# Altium schematic sheet 01_DC_Power.SchDoc
size A3
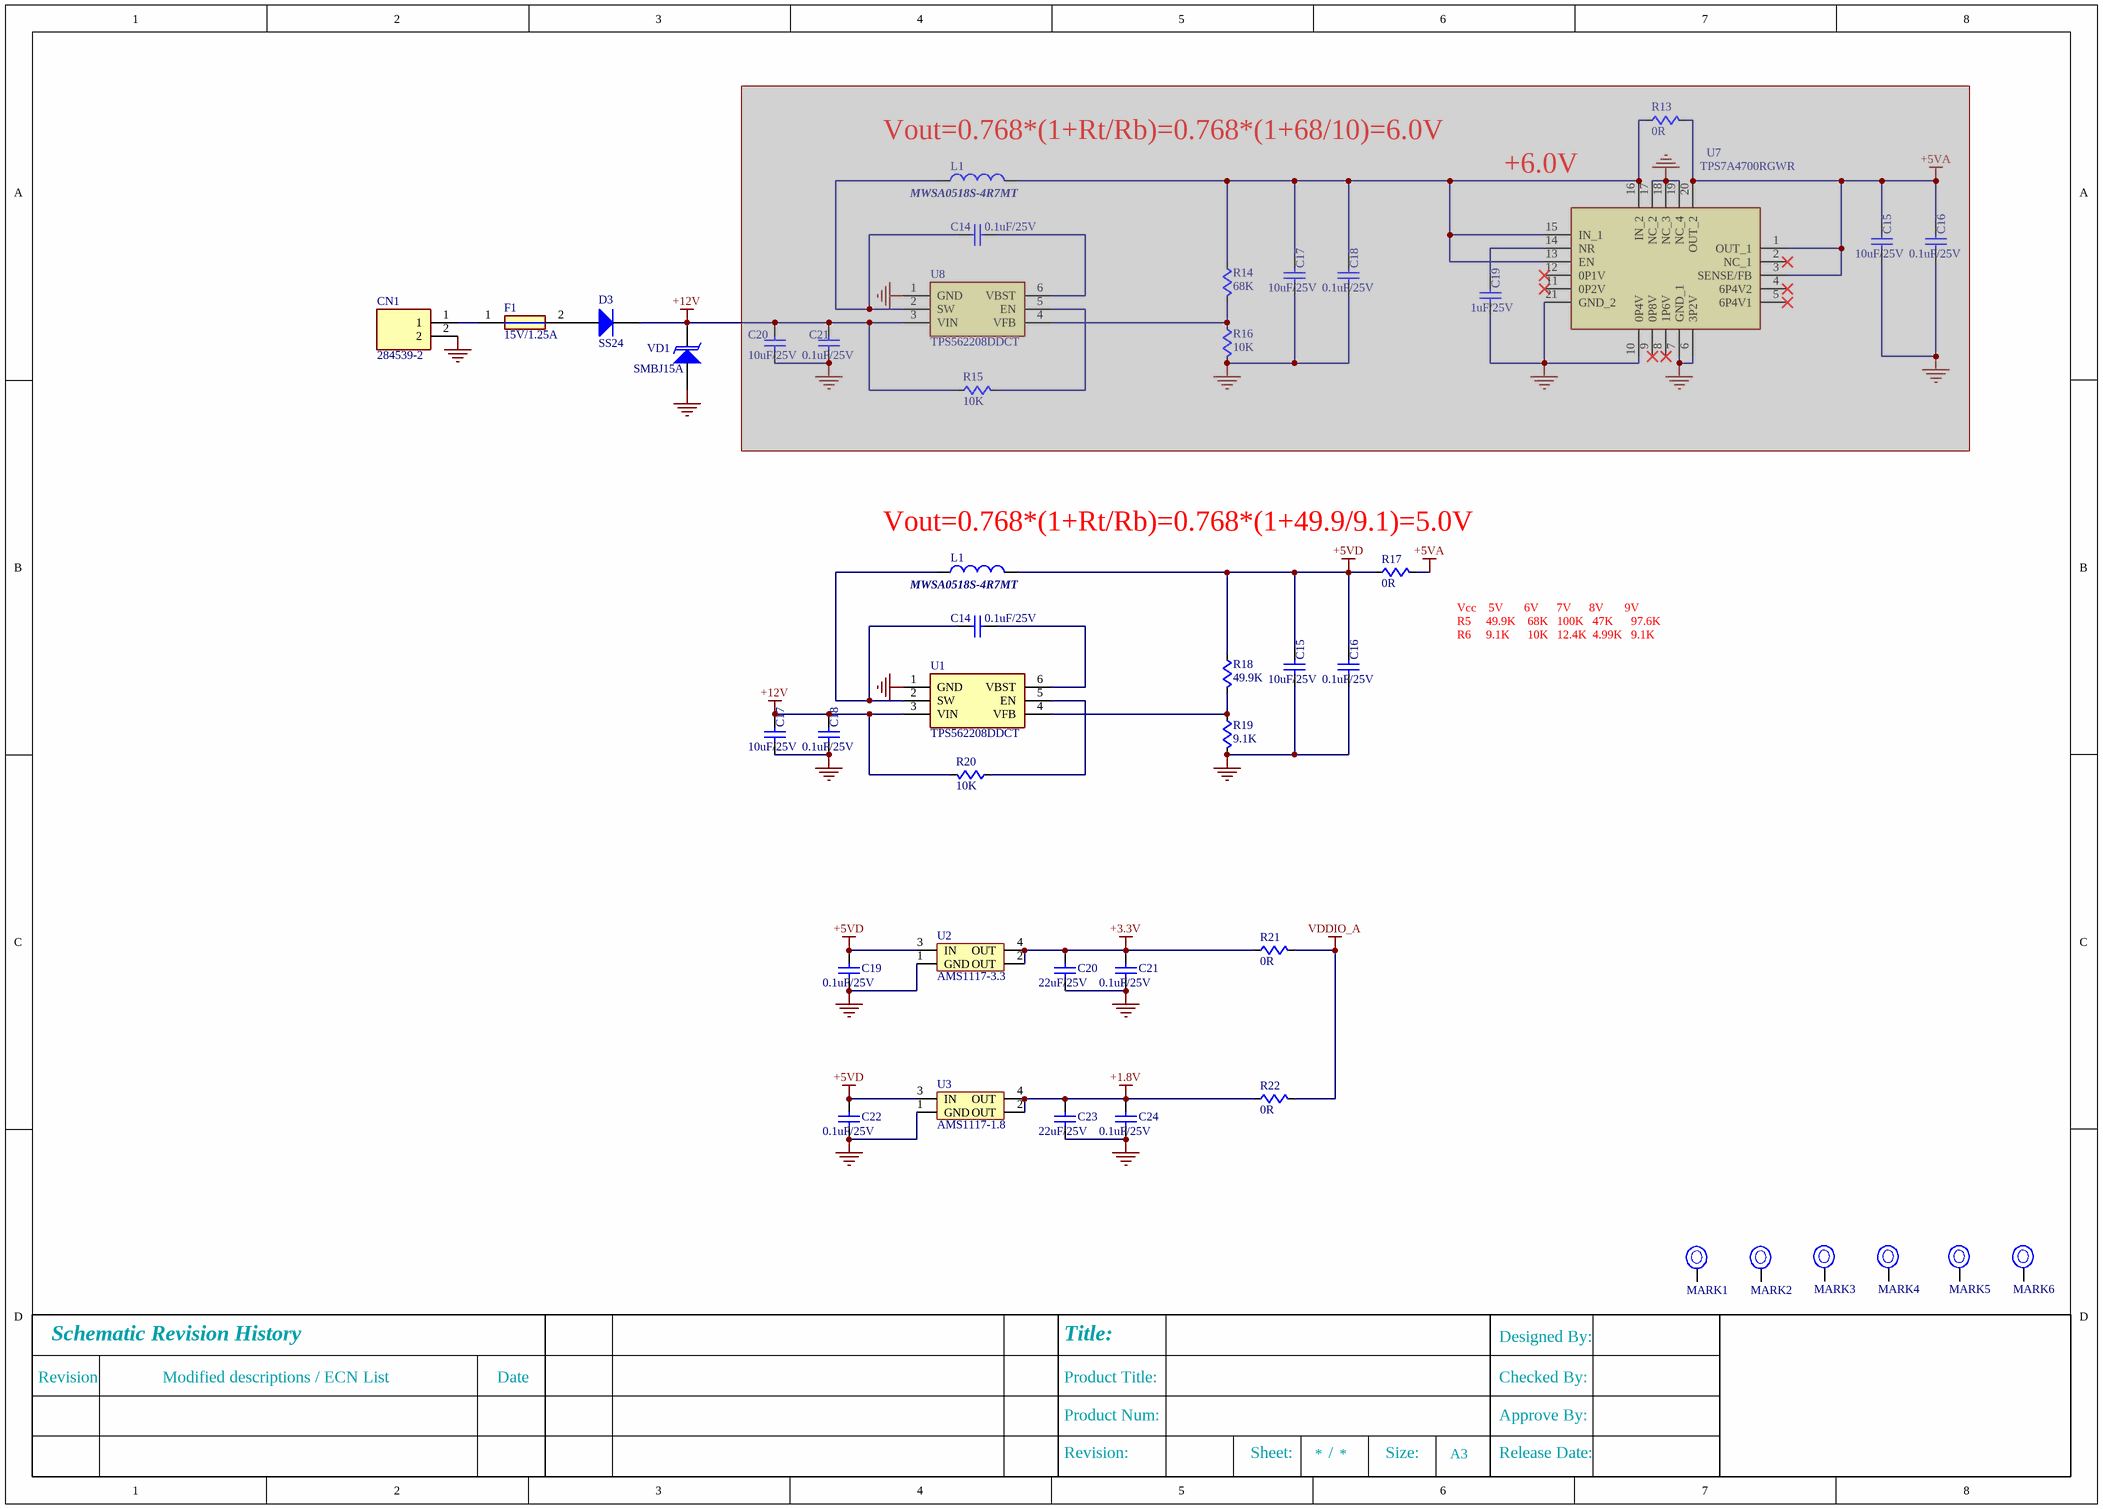
[diagram p0: 01_DC_Power.SchDoc]

## Parts
(Parts that share a designator on the sheet are numbered #1, #2 ... from top to bottom, then left to right.)
C14#1  0.1uF/25V  [C0603]  (masked out: inside a compile mask, not in the netlist)
C14#2  0.1uF/25V  [C0603]
C15#1  10uF/25V  [C1206]  (masked out: inside a compile mask, not in the netlist)
C15#2  10uF/25V  [C1206]
C16#1  0.1uF/25V  [C0603]  (masked out: inside a compile mask, not in the netlist)
C16#2  0.1uF/25V  [C0603]
C17#1  10uF/25V  [C1206]  (masked out: inside a compile mask, not in the netlist)
C17#2  10uF/25V  [C1206]
C18#1  0.1uF/25V  [C0603]  (masked out: inside a compile mask, not in the netlist)
C18#2  0.1uF/25V  [C0603]
C19#1  1uF/25V  [C0603]  (masked out: inside a compile mask, not in the netlist)
C19#2  0.1uF/25V  [C0603]
C20#1  10uF/25V  [C1206]  (masked out: inside a compile mask, not in the netlist)
C20#2  22uF/25V  [C1210]
C21#1  0.1uF/25V  [C0603]  (masked out: inside a compile mask, not in the netlist)
C21#2  0.1uF/25V  [C0603]
C22  0.1uF/25V  [C0603]
C23  22uF/25V  [C1210]
C24  0.1uF/25V  [C0603]
CN1  284539-2  [2845392]
D3  SS24  [SMB]
F1  15V/1.25A  [FUSC7451X100N]
L1#1  MWSA0518S-4R7MT  [MWSA0518S]  (masked out: inside a compile mask, not in the netlist)
L1#2  MWSA0518S-4R7MT  [MWSA0518S]
MARK1  Mark Point  [Mark point]  (value not drawn)
MARK2  Mark Point  [Mark point]  (value not drawn)
MARK3  Mark Point  [Mark point]  (value not drawn)
MARK4  Mark Point  [Mark point]  (value not drawn)
MARK5  Mark Point  [Mark point]  (value not drawn)
MARK6  Mark Point  [Mark point]  (value not drawn)
R13  0R  [R0805]  (masked out: inside a compile mask, not in the netlist)
R14  68K  [R0603]  (masked out: inside a compile mask, not in the netlist)
R15  10K  [R0603]  (masked out: inside a compile mask, not in the netlist)
R16  10K  [R0603]  (masked out: inside a compile mask, not in the netlist)
R17  0R  [R0805]
R18  49.9K  [R0603]
R19  9.1K  [R0603]
R20  10K  [R0603]
R21  0R  [R0805]
R22  0R  [R0805]
U1  TPS562208DDCT  [SOT95P280X110-6N]
U2  AMS1117-3.3  [AMS1117]
U3  AMS1117-1.8  [AMS1117]
U7  TPS7A4700RGWR  [QFN65P500X500X100-21N-D]  (masked out: inside a compile mask, not in the netlist)
U8  TPS562208DDCT  [SOT95P280X110-6N]  (masked out: inside a compile mask, not in the netlist)
VD1  SMBJ15A  [SMB]

## Nets
+1.8V: C23.2 C24.2 R22.1 U3.2(OUT) U3.4(OUT)
+3.3V: C20#2.2 C21#2.2 R21.1 U2.2(OUT) U2.4(OUT)
+5VA: R17.2
+5VD: C15#2.1 C16#2.1 C19#2.2 C22.2 L1#2.1 R17.1 R18.1 U2.3(IN) U3.3(IN)
+12V: C17#2.1 C18#2.1 D3.2(K) R20.2 U1.3(VIN) VD1.2(K)
GND: C15#2.2 C16#2.2 C17#2.2 C18#2.2 C19#2.1 C20#2.1 C21#2.1 C22.1 C23.1 C24.1 CN1.2 R19.2 U1.1(GND) U2.1(GND) U3.1(GND) VD1.1(A)
VDDIO_A: R21.2 R22.2
NetC14#2_1: C14#2.1 L1#2.2 U1.2(SW)
NetC14#2_2: C14#2.2 U1.6(VBST)
NetCN1_1: CN1.1 F1.1
NetD3_1: D3.1(A) F1.2
NetR18_2: R18.2 R19.1 U1.4(VFB)
NetR20_1: R20.1 U1.5(EN)

Not connected (* = marked no-connect by the designer): MARK1 1; MARK2 1; MARK3 1; MARK4 1; MARK5 1; MARK6 1

## Notes on the sheet
- (near L1#1) Vout=0.768*(1+Rt/Rb)=0.768*(1+68/10)=6.0V
- (near U7) +6.0V
- Vout=0.768*(1+Rt/Rb)=0.768*(1+49.9/9.1)=5.0V
- Vcc    5V       6V      7V      8V       9V
  R5     49.9K    68K   100K   47K      97.6K
  R6     9.1K      10K   12.4K  4.99K   9.1K
- Revision
- Schematic Revision History
- Modified descriptions / ECN List
- Date
- Product Title:
- Title:
- Checked By:
- Designed By:
- Revision:
- Product Num:
- Sheet:
- /
- Size:
- A3
- Approve By:
- Release Date:
- Title
- Date:
- Number:
- Time:
- Sheet
- of
- File:

## Library data of the parts
C14#1 C14#2 C15#1 C15#2 C16#1 C16#2 C17#1 C17#2 C18#1 C18#2 C19#1 C19#2 C20#1 C20#2 C21#1 C21#2 C22-C24 = C: MLCC
CN1 = 284539-2: Connector; Manufacturer_Name: TE Connectivity; Datasheet Link: http://www.te.com/commerce/DocumentDelivery/DDEController?Action=showdoc&DocId=Customer+Drawing%7F284539%7FB1%7Fpdf%7FEnglish%7FENG_CD_284539_B1.pdf%7F284539-2; Height: 7.4mm; Manufacturer_Part_Number: 284539-2; Mouser Part Number: 571-284539-2; Mouser Price/Stock: https://www.mouser.co.uk/ProductDetail/TE-Connectivity/284539-2?qs=lyRJTFulC0ZdkPBib8mRwg%3D%3D; Arrow Part Number: 284539-2; Arrow Price/Stock: https://www.arrow.com/en/products/284539-2/te-connectivity?region=nac
D3 = Diode(SMD): 二极管; U_TABLE: U_103; 物料描述: 扬杰科技SMT快恢复管E1A
F1 = 2920L125PR: Manufacturer_Name: LITTELFUSE; Datasheet Link: https://datasheet.lcsc.com/szlcsc/1907051732_Littelfuse-2920L125PR_C192524.pdf; Height: 1mm; Manufacturer_Part_Number: 2920L125PR; Mouser Part Number: 576-2920L125; Mouser Price/Stock: https://www.mouser.co.uk/ProductDetail/Littelfuse/2920L125PR?qs=SJZ%252BTX%252BI2BSHRP6GPsgTlw%3D%3D; Arrow Part Number: 2920L125PR; Arrow Price/Stock: https://www.arrow.com/en/products/2920l125pr/littelfuse?region=nac
L1#1 L1#2 = 3015/22uH/0.6A: 贴片电感器，顺络; 1-物料编码: 160701546; 1-物料描述: SMT电感SPH4018H150MT_15uH_顺络_EHRA; 物料品名: 贴片电感; 物料优选等级: 无
R13-R22 = R: 贴片电阻
U1 U8 = TPS562208DDCT: Integrated Circuit; Manufacturer_Name: Texas Instruments; Datasheet Link: http://www.ti.com/lit/gpn/TPS562208; Height: 1.1mm; Manufacturer_Part_Number: TPS562208DDCT; Mouser Part Number: 595-TPS562208DDCT; Mouser Price/Stock: https://www.mouser.co.uk/ProductDetail/Texas-Instruments/TPS562208DDCT?qs=G55MHhPmvtKSn8TVxo8Xvw%3D%3D; Arrow Part Number: TPS562208DDCT; Arrow Price/Stock: https://www.arrow.com/en/products/tps562208ddct/texas-instruments
U2 U3 = AMS1117: AMS公司，SOT-223
U7 = TPS7A4700RGWR: Integrated Circuit; Manufacturer_Name: Texas Instruments; Datasheet Link: http://www.ti.com/lit/gpn/tps7a47; Height: 1mm; Manufacturer_Part_Number: TPS7A4700RGWR; Mouser Part Number: 595-TPS7A4700RGWR; Mouser Price/Stock: https://www.mouser.co.uk/ProductDetail/Texas-Instruments/TPS7A4700RGWR?qs=b5Ofe9I6AaEq0TfoG6v9lA%3D%3D; Arrow Part Number: TPS7A4700RGWR; Arrow Price/Stock: https://www.arrow.com/en/products/tps7a4700rgwr/texas-instruments?region=nac
VD1 = Diode(TVS): TVS管; U_TABLE: U_103